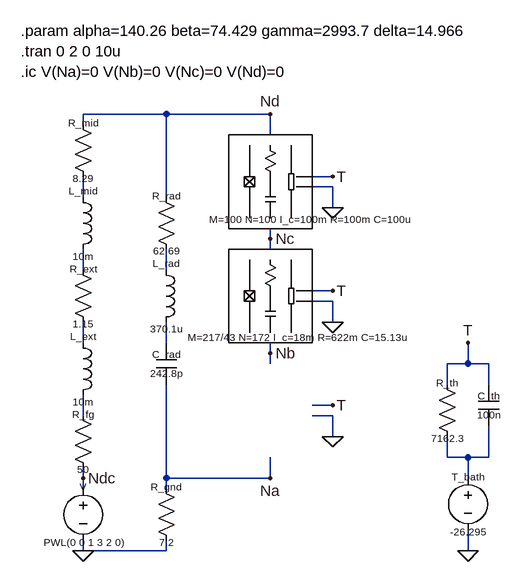
[diagram p0: schematic JPE_3stacks_RC_modified_1.asc]
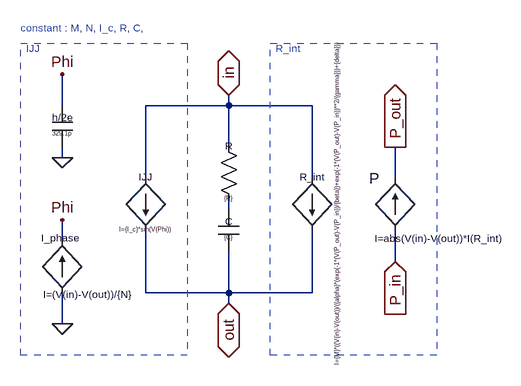
[diagram p1: sub-circuit 1stack_rc.asc]
JPE_3stacks_RC_modified_1.asc, the LTspice schematic file:
Version 4
SHEET 1 1820 680
WIRE 544 -512 416 -512
WIRE 704 -512 544 -512
WIRE 416 -496 416 -512
WIRE 704 -480 704 -512
WIRE 800 -416 768 -416
WIRE 800 -400 768 -400
WIRE 416 -384 416 -416
WIRE 544 -384 544 -512
WIRE 800 -368 800 -400
WIRE 704 -320 704 -336
WIRE 704 -304 704 -320
WIRE 416 -272 416 -304
WIRE 544 -272 544 -304
WIRE 800 -240 768 -240
WIRE 800 -224 768 -224
WIRE 800 -192 800 -224
WIRE 416 -160 416 -192
WIRE 544 -160 544 -192
WIRE 704 -144 704 -160
WIRE 704 -128 704 -144
WIRE 1008 -128 1008 -160
WIRE 1008 -128 976 -128
WIRE 1040 -128 1008 -128
WIRE 976 -96 976 -128
WIRE 1040 -96 1040 -128
WIRE 800 -64 768 -64
WIRE 416 -48 416 -80
WIRE 800 -48 768 -48
WIRE 800 -16 800 -48
WIRE 976 16 976 -16
WIRE 1008 16 976 16
WIRE 1040 16 1040 -32
WIRE 1040 16 1008 16
WIRE 416 48 416 32
WIRE 544 48 544 -96
WIRE 704 48 704 16
WIRE 704 48 544 48
WIRE 1008 48 1008 16
WIRE 416 64 416 48
WIRE 544 64 544 48
WIRE 416 160 416 144
WIRE 544 160 544 144
WIRE 544 160 416 160
WIRE 1008 160 1008 128
FLAG 416 160 0
FLAG 704 -144 Nb
FLAG 704 48 Na
FLAG 704 -320 Nc
FLAG 704 -512 Nd
FLAG 416 48 Ndc
FLAG 1008 -160 T
FLAG 800 -16 0
FLAG 800 -368 0
FLAG 800 -192 0
FLAG 800 -416 T
FLAG 800 -240 T
FLAG 800 -64 T
FLAG 1008 160 0
SYMBOL voltage 416 48 R0
WINDOW 0 0 24 Bottom 1
WINDOW 3 0 88 Top 1
SYMATTR InstName V
SYMATTR Value PWL(0 0 1 3 2 0)
SYMBOL res 400 -64 R0
WINDOW 0 16 24 Bottom 1
WINDOW 3 16 88 Top 1
SYMATTR InstName R_fg
SYMATTR Value 50
SYMBOL ind 400 -176 R0
WINDOW 0 16 16 Bottom 1
WINDOW 3 16 96 Top 1
SYMATTR InstName L_ext
SYMATTR Value 10m
SYMBOL res 400 -288 R0
WINDOW 0 16 24 Bottom 1
WINDOW 3 16 88 Top 1
SYMATTR InstName R_ext
SYMATTR Value 1.15
SYMBOL ind 400 -400 R0
WINDOW 0 16 16 Bottom 1
WINDOW 3 16 96 Top 1
SYMATTR InstName L_mid
SYMATTR Value 10m
SYMBOL ind 528 -288 R0
WINDOW 0 16 16 Bottom 1
WINDOW 3 16 96 Top 1
SYMATTR InstName L_rad
SYMATTR Value 370.1u
SYMBOL res 528 -400 R0
WINDOW 0 16 24 Bottom 1
WINDOW 3 16 88 Top 1
SYMATTR InstName R_rad
SYMATTR Value 62.69
SYMBOL cap 528 -160 R0
WINDOW 0 16 28 Bottom 1
WINDOW 3 16 36 Top 1
SYMATTR InstName C_rad
SYMATTR Value 242.8p
SYMBOL res 528 48 R0
WINDOW 0 16 24 Bottom 1
WINDOW 3 16 88 Top 1
SYMATTR InstName R_gnd
SYMATTR Value 7.2
SYMBOL voltage 1008 32 R0
WINDOW 0 0 24 Bottom 1
WINDOW 3 0 88 Top 1
SYMATTR InstName T_bath
SYMATTR Value -26.295
SYMBOL res 960 -112 R0
WINDOW 0 16 24 Bottom 1
WINDOW 3 16 88 Top 1
SYMATTR InstName R_th
SYMATTR Value 7162.3
SYMBOL cap 1024 -96 R0
WINDOW 0 16 28 Bottom 1
WINDOW 3 16 36 Top 1
SYMATTR InstName C_th
SYMATTR Value 100n
SYMBOL res 400 -512 R0
WINDOW 0 16 24 Bottom 1
WINDOW 3 16 88 Top 1
SYMATTR InstName R_mid
SYMATTR Value 8.29
SYMBOL 1stack_RC 704 -416 R0
WINDOW 0 0 -64 Invisible 1
WINDOW 39 59 76 Bottom 1
SYMATTR InstName X1
SYMATTR SpiceLine M=100 N=100 I_c=100m R=100m C=100u
SYMBOL 1stack_RC 704 -240 R0
WINDOW 0 0 -64 Invisible 1
WINDOW 39 -127 71 Left 1
SYMATTR InstName X2
SYMATTR SpiceLine M=217/43 N=172 I_c=18m R=622m C=15.13u
TEXT 320 -640 Left 2 !.param alpha=140.26 beta=74.429 gamma=2993.7 delta=14.966\n.tran 0 2 0 10u\n.ic V(Na)=0 V(Nb)=0 V(Nc)=0 V(Nd)=0

1stack_rc.asc, the sub-circuit schematic file:
Version 4
SHEET 1 880 680
WIRE -32 16 -32 -32
WIRE 224 16 224 0
WIRE 224 16 96 16
WIRE 352 16 224 16
WIRE 224 80 224 16
WIRE -32 96 -32 80
WIRE 96 128 96 16
WIRE 352 128 352 16
WIRE 480 128 480 80
WIRE 224 176 224 160
WIRE -32 224 -32 192
WIRE 480 256 480 208
WIRE 96 304 96 208
WIRE 224 304 224 240
WIRE 224 304 96 304
WIRE 352 304 352 208
WIRE 352 304 224 304
WIRE 224 320 224 304
WIRE -32 352 -32 304
FLAG 224 0 in
IOPIN 224 0 BiDir
FLAG 224 320 out
IOPIN 224 320 BiDir
FLAG 480 80 P_out
IOPIN 480 80 Out
FLAG 480 256 P_in
IOPIN 480 256 In
FLAG -32 352 0
FLAG -32 96 0
FLAG -32 192 Phi
FLAG -32 -32 Phi
SYMBOL bi 96 128 R0
WINDOW 0 0 8 Bottom 1
WINDOW 3 0 72 Top 0
SYMATTR InstName IJJ
SYMATTR Value I={I_c}*sin(V(Phi))
SYMBOL bi 352 128 R0
WINDOW 0 0 8 Bottom 1
WINDOW 3 32 32 VTop 0
SYMATTR InstName R_int
SYMATTR Value I={M}*((V(in)-V(out))/({alpha}*(exp(-1*(V(P_out)-V(P_in))/{beta})+exp(-1*(V(P_out)-V(P_in))**2/{gamma}))+{delta}))
SYMBOL res 208 64 R0
WINDOW 0 16 24 Bottom 1
WINDOW 3 16 88 Top 0
SYMATTR InstName R
SYMATTR Value {R}
SYMBOL cap 208 176 R0
WINDOW 0 16 28 Bottom 1
WINDOW 3 16 36 Top 0
SYMATTR InstName C
SYMATTR Value {C}
SYMBOL bi 480 208 R180
WINDOW 0 24 80 Left 2
WINDOW 3 -162 -12 Left 1
SYMATTR InstName P
SYMATTR Value I=abs(V(in)-V(out))*I(R_int)
SYMBOL bi -32 304 R180
WINDOW 0 -25 85 Left 1
WINDOW 3 -106 -2 Left 1
SYMATTR InstName I_phase
SYMATTR Value I=(V(in)-V(out))/{N}
SYMBOL cap -48 16 R0
WINDOW 0 16 28 Bottom 1
WINDOW 3 16 36 Top 0
SYMATTR InstName h/2e
SYMATTR Value 329.1p
TEXT -96 -104 Left 1 ;constant : M, N, I_c, R, C,
TEXT -88 -72 Left 1 ;IJJ
TEXT 296 -72 Left 1 ;R_int
RECTANGLE Normal -96 -80 160 400 2
RECTANGLE Normal 544 400 288 -80 2

The netlist it stands for:
* JPE_3stacks_RC_modified_1.asc
V Ndc 0 PWL(0 0 1 3 2 0)
R_fg N006 Ndc 50
L_ext N004 N006 10m
R_ext N002 N004 1.15
L_mid N001 N002 10m
L_rad N003 N005 370.1u
R_rad Nd N003 62.69
C_rad N005 Na 242.8p
R_gnd Na 0 7.2
V§T_bath N007 0 -26.295
R_th T N007 7162.3
C_th T N007 100n
R_mid Nd N001 8.29
XX1 Nd Nc T 0 1stack_rc params: M=100 N=100 I_c=100m R=100m C=100u
XX2 Nc Nb T 0 1stack_rc params: M=217/43 N=172 I_c=18m R=622m C=15.13u

* block symbol definitions
.subckt 1stack_rc in out P_out P_in
B§IJJ in out I={I_c}*sin(V(Phi))
B§R_int in out I={M}*((V(in)-V(out))/({alpha}*(exp(-1*(V(P_out)-V(P_in))/{beta})+exp(-1*(V(P_out)-V(P_in))**2/{gamma}))+{delta}))
R in N001 {R}
C N001 out {C}
B§P P_in P_out I=abs(V(in)-V(out))*I(R_int)
B§I_phase 0 Phi I=(V(in)-V(out))/{N}
C§h/2e Phi 0 329.1p
* constant : M, N, I_c, R, C,
* IJJ
* R_int
.ends 1stack_rc

.param alpha=140.26 beta=74.429 gamma=2993.7 delta=14.966
.tran 0 2 0 10u
.ic V(Na)=0 V(Nb)=0 V(Nc)=0 V(Nd)=0
.backanno
.end